# EAGLE design Keg Cop - Daisy Chain Molex (EAGLE 9.5.2)
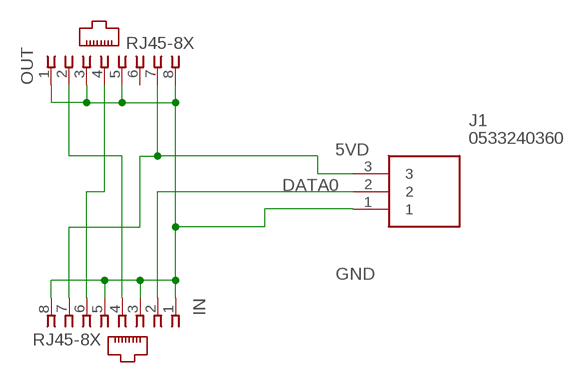
[diagram p0: schematic, sheet 1]

## Parts
IN  RJ45-8X  [RJ45-NO-SHIELD]
J1  0533240360  [0533240360]
OUT  RJ45-8X  [RJ45-NO-SHIELD]

## Nets
5VD: IN.7 J1.3 OUT.7
DATA0: IN.2 J1.2
DATA1: IN.4 OUT.2
DATA2: IN.6 OUT.4
GND: IN.1 IN.3 IN.5 IN.8 J1.1 OUT.1 OUT.3 OUT.5 OUT.8
Unconnected: OUT.6

## Library data of the parts
IN OUT = con-tycoelectronics:RJ45: CORCOM Modular RJ Jacks No Shield Source: www.tycoelectronics.com .. ENG_DS_1654001_1099_RJ_L_0507.pdf; MPN: RJ45-8X; OC_FARNELL: unknown; OC_NEWARK: 16R6101
J1 = SamacSys_Parts:0533240360: Conn Shrouded Header (4 Sides) HDR 3 POS 2mm Solder ST Thru-Hole Mi II Source: Datasheet <https://www.molex.com/pdm_docs/sd/533240260_sd.pdf>; ARROW_PART_NUMBER: 0533240360; ARROW_PRICE-STOCK: https://www.arrow.com/en/products/0533240360/molex; DESCRIPTION: Conn Shrouded Header (4 Sides) HDR 3 POS 2mm Solder ST Thru-Hole Mi II; HEIGHT: 6.2mm; MANUFACTURER_NAME: Molex; MANUFACTURER_PART_NUMBER: 0533240360; MOUSER_PART_NUMBER: N/A; MOUSER_PRICE-STOCK: https://www.mouser.co.uk/ProductDetail/Molex/0533240360?qs=PBcRNPEHKsqkWdh5nxv5XA%3D%3D

## Board
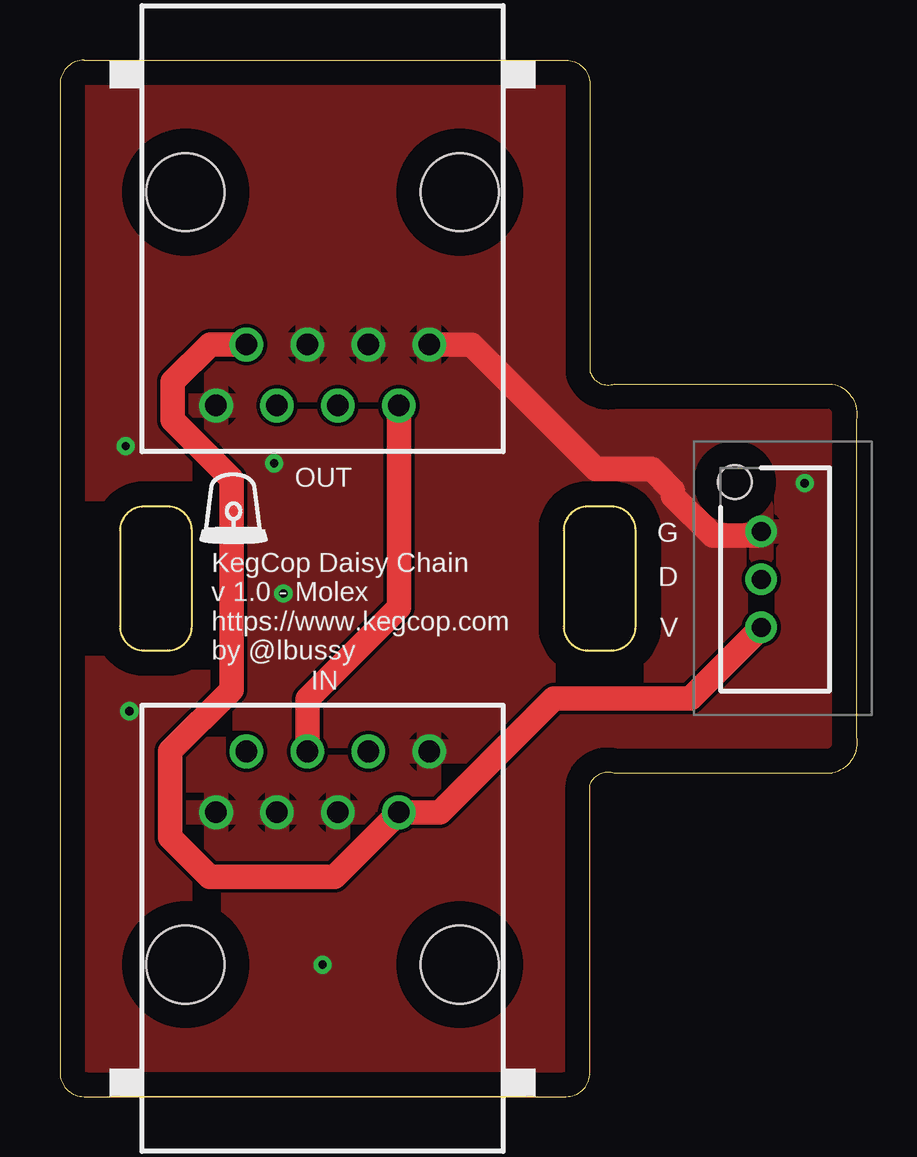
[diagram p1: board, top side]
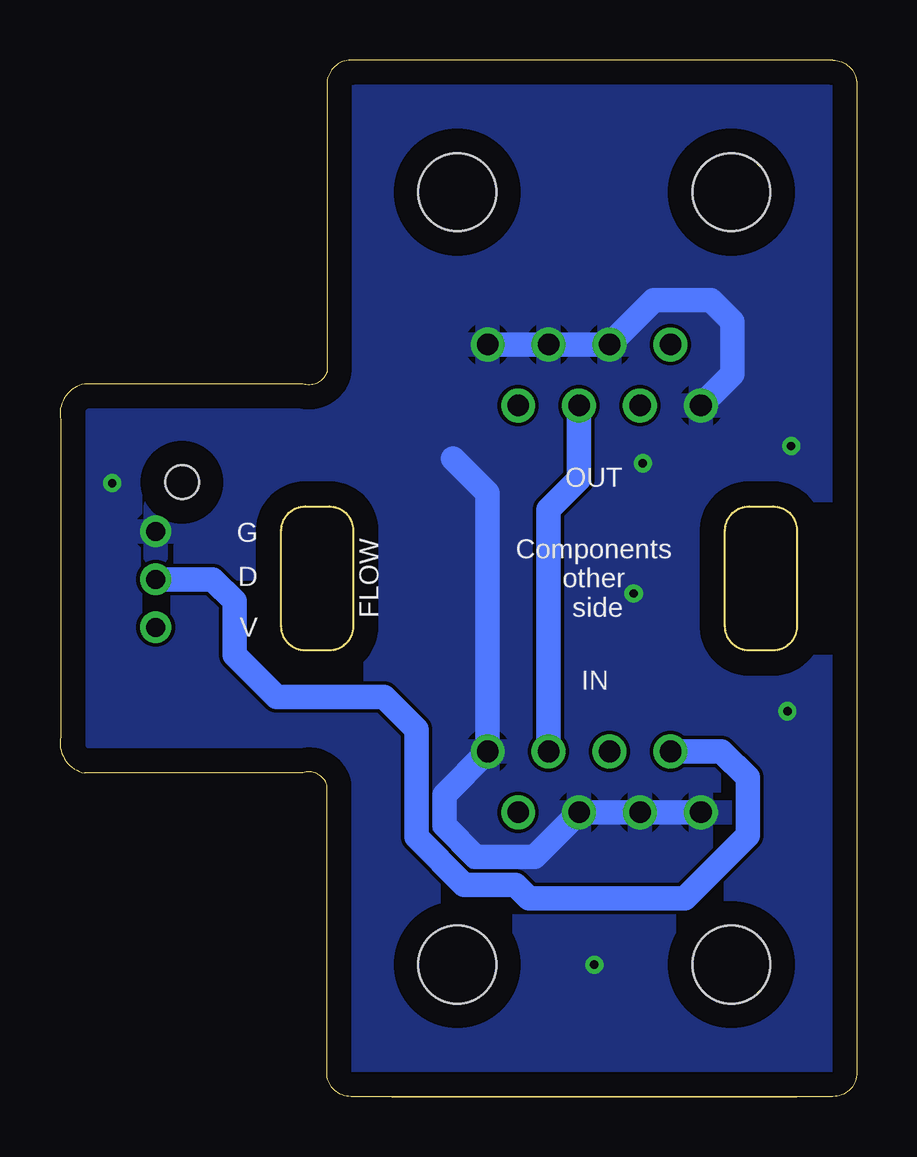
[diagram p2: board, bottom side, seen from below]

Size 33.23 x 43.22 mm. Coordinates in mm from the lower left corner, seen from the top.
Outline: 1,43.21 21.1,43.21 arc-90 22.1,42.21 22.1,30.21 arc90 23.1,29.72 32.2,29.72 arc-90 33.2,28.21 33.2,15.01 arc-90 32.2,13.5 23.1,13.5 arc90 22.1,13.01 22.1,1.01 arc-90 21.1,0.01 1,0.01 arc-90 0,1.01 0,42.21 arc-90 1,43.21
Outline: 4.5,24.61 3.5,24.61 arc90 2.5,23.61 2.5,19.61 arc90 3.5,18.61 4.5,18.61 arc90 5.5,19.61 5.5,23.61 arc90 4.5,24.61
Outline: 22,18.61 23,18.61 arc90 24,19.61 24,23.61 arc90 23,24.61 22,24.61 arc90 21,23.61 21,19.61 arc90 22,18.61
Copper layers (1*16): Top 0.035mm / dielectric 1.5mm / Bottom 0.035mm
Design rules "default *": minimum track width 6mil, minimum drill 0.35mm, track to track 6mil, track to pad 6mil, pad to pad 6mil, via to via 6mil, smd to smd 6mil, copper to edge 40mil, drill to drill 6mil, minimum pad ring 10mil, minimum via ring 8mil, stop-mask expansion 4mil, vias tented up to drill 30mil, thermal gap 10mil

### Footprints (pad centres in the part's own frame; a part is rotated, then mirrored left to right if it is on the bottom)
RJ45-NO-SHIELD = drill 0.9 pad 1.4: 1 -4.445,6.35; 2 -3.175,8.89; 3 -1.905,6.35; 4 -0.635,8.89; 5 0.635,6.35; 6 1.905,8.89; 7 3.175,6.35; 8 4.445,8.89 | hole 3.251: -5.715,0; 5.715,0
0533240360 = drill 0.8 pad 1.3: 1 0,0; 2 -2,0; 3 -4,0 | hole 1.4: 2.05,1.1

### Placement (x,y rotation side)
IN  10.95,5.51 0 top
J1  29.24,23.57 90 top
OUT  10.95,37.71 180 top

### Tracks (layer width: path | path; a pad name or v marks a point on that pad's centre or on a via)
5VD
  Top 1.016: OUT.7 6.25,31.36 4.7,29.81 4.7,28.21 7.15,25.76 7.15,16.96 4.6,14.41 4.6,10.81 6.23,9.18 11.44,9.18 IN.7 15.85,11.86 20.6,16.61 26.27,16.61 J1.3
DATA0
  Bottom 1.016: J1.2 26.85,21.57 25.94,20.66 25.94,18.42 24.19,16.66 19.71,16.66 18.37,15.32 18.37,10.83 16.38,8.84 14.23,8.84 13.66,8.28 7.18,8.28 4.56,10.9 4.56,13.31 5.65,14.4 IN.2
DATA1
  Top 1.016: IN.4 10.31,16.59 14.12,20.4 OUT.2
DATA2
  Bottom 1.016: IN.6 12.86,24.48 11.59,25.75 OUT.4
GND  (via drill 0.35)
  Top 1.016: OUT.1 17.15,31.36 22.34,26.17 24.67,26.17 25.56,25.28 25.56,25.05 27.21,23.4 29.06,23.4 J1.1 29.22,23.56
  Bottom 1.016: IN.1 IN.3 IN.5 13.44,10.01 15.9,10.01 17.2,11.31 17.2,12.6 IN.8 15.39,25.17 16.84,26.61 | OUT.1 OUT.3 OUT.5 8.46,33.21 6.1,33.21 5.2,32.31 5.2,30.13 OUT.8
  other vias: 10.95,5.51 8.93,26.41 9.31,20.98 31.05,25.58 2.9,16.08 2.74,27.13
  pour Top: 21.1,0.01 1,0.01 arc-90 0,1.01 0,42.21 arc-90 1,43.21 21.1,43.21 arc-90 22.1,42.21 22.1,30.21 arc90 23.1,29.21 32.2,29.21 arc-90 33.2,28.21 33.2,15.01 arc-90 32.2,14.01 23.1,14.01 arc90 22.1,13.01 22.1,1.01 arc-90
  pour Bottom: 21.1,0.01 1,0.01 arc-90 0,1.01 0,42.21 arc-90 1,43.21 21.1,43.21 arc-90 22.1,42.21 22.1,30.21 arc90 23.1,29.21 32.2,29.21 arc-90 33.2,28.21 33.2,15.01 arc-90 32.2,14.01 23.1,14.01 arc90 22.1,13.01 22.1,1.01 arc-90

### Text on the board
tNames: G | D | V | KegCop Daisy Chain / v 1.0 - Molex / https://www.kegcop.com / by @lbussy
bNames: OUT | G | Components / other / side | FLOW | D | V | IN